# EAGLE schematic VCF-LM324-Stereo-LFO (EAGLE 7.6.0)
Voltage-Controlled Low-Pass Filter with LFO using LM324 Quad-Opamp (Stereo) http://electro-music.com/forum/topic-45231-0.html&postdays=0&postorder=asc&highlight=
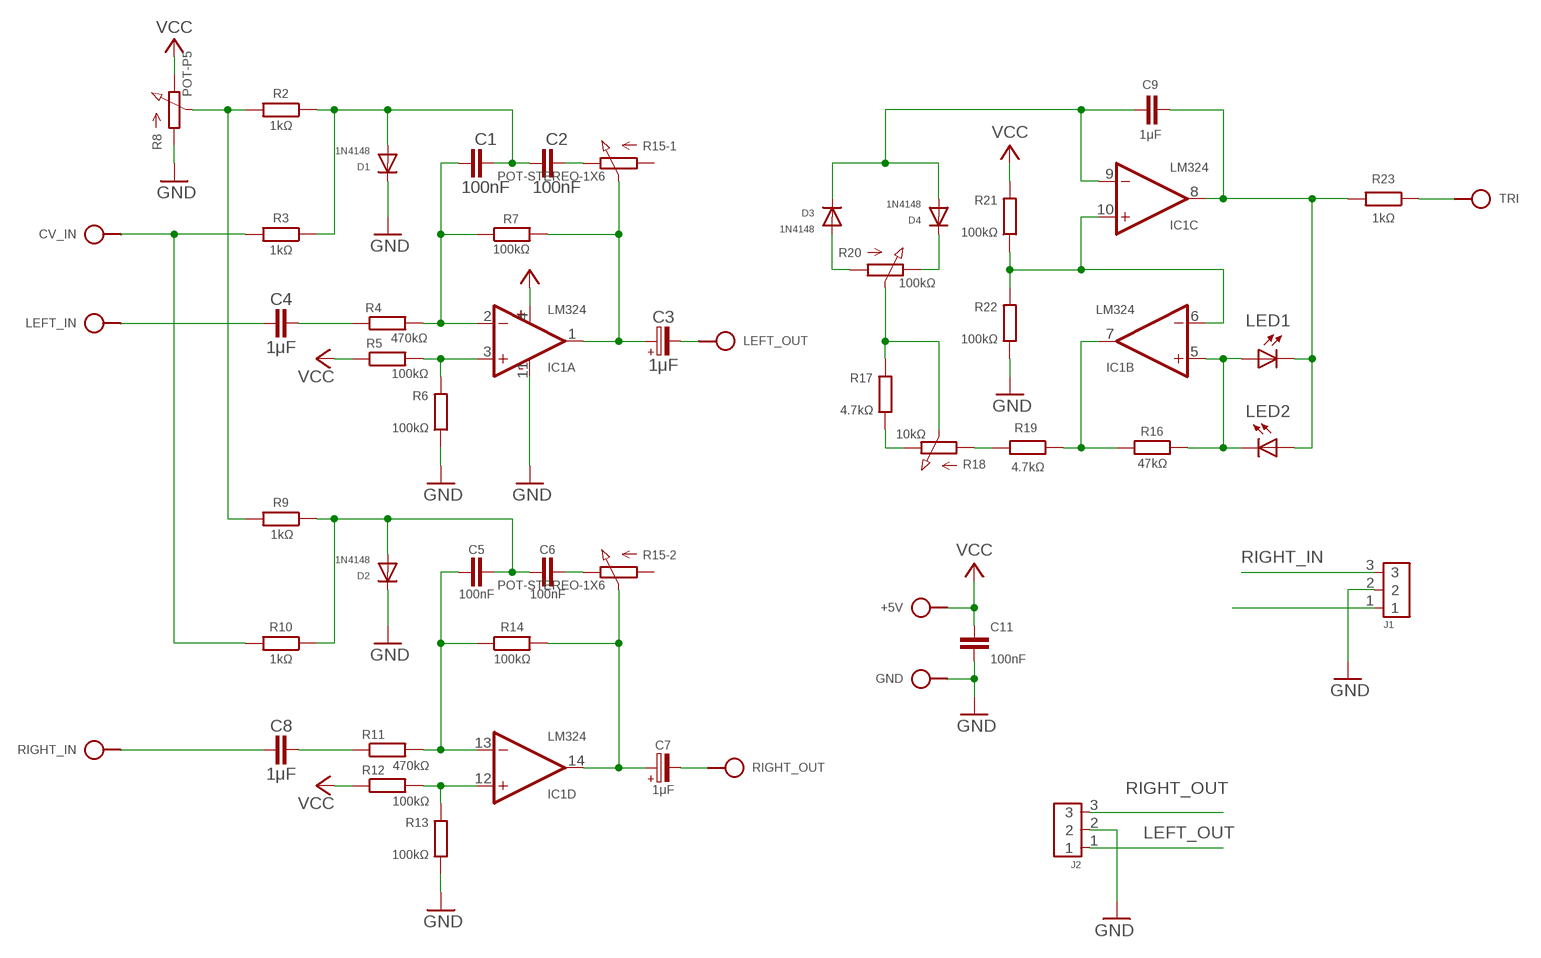
[diagram p0: schematic, sheet 1]

## Parts
+5V  VCC  SPAD  [SPAD]
C1  100nF  C050-024X044  [C050-024X044]
C2  100nF  C050-024X044  [C050-024X044]
C3  1μF  CPOLE2,5-3  [E2,5-3]
C4  1μF  C050-020X044  [C050-020X044]
C5  100nF  C050-024X044  [C050-024X044]
C6  100nF  C050-024X044  [C050-024X044]
C7  1μF  CPOLE2,5-3  [E2,5-3]
C8  1μF  C050-020X044  [C050-020X044]
C9  1μF  C050-024X044/V  [C050-024X044/V]
C11  100nF  C050-020X036  [C050-020X036]
CV_IN  CV_IN  SPAD  [SPAD]
D1  1N4148  1N414834-5  [DO34-5]
D2  1N4148  1N414834-7V  [DO34-7V]
D3  1N4148  1N414834-7V  [DO34-7V]
D4  1N4148  1N414834-7V  [DO34-7V]
GND  GND  SPAD  [SPAD]
IC1  LM324  LM324N  [DIL14]
J1  CONN-3P-3P  [CONN-3P]
J2  CONN-3P-3P  [CONN-3P]
LED1  LED3MM  [LED3MM]
LED2  LED3MM  [LED3MM]
LEFT_IN  AUDIO_IN  SPAD  [SPAD]
LEFT_OUT  AUDIO_OUT  SPAD  [SPAD]
R2  1kΩ  R0204/10-V  [0204/10-V]
R3  1kΩ  R0204/7-V  [0204/7-V]
R4  470kΩ  R0204/10-V  [0204/10-V]
R5  100kΩ  R0204V  [0204V]
R6  100kΩ  R0204/10  [0204/10]
R7  100kΩ  R0204/7-V  [0204/7-V]
R8  POT-P5  [POT-P5]
R9  1kΩ  R0204/7-V  [0204/7-V]
R10  1kΩ  R0202/7-V  [0202/7-V]
R11  470kΩ  R0204/10  [0204/10]
R12  100kΩ  R0204/7-V  [0204/7-V]
R13  100kΩ  R0204V  [0204V]
R14  100kΩ  R0204V  [0204V]
R15  POT-STEREO-1X6  [POT-STEREO-1X6]
R16  47kΩ  R0204/7  [0204/7]
R17  4.7kΩ  R0204/7  [0204/7]
R18  10kΩ  POT  [POT]
R19  4.7kΩ  R0204/7-V  [0204/7-V]
R20  100kΩ  POT  [POT]
R21  100kΩ  R0204/10  [0204/10]
R22  100kΩ  R0202V  [0202V]
R23  1kΩ  R0204/10  [0204/10]
RIGHT_IN  AUDIO_IN  SPAD  [SPAD]
RIGHT_OUT  AUDIO_OUT  SPAD  [SPAD]
TRI  TRIANGLE  SPAD  [SPAD]

## Nets
GND: C11.2 D1.C D2.C GND.1 IC1.11(P:V-) J1.2 J2.2 R6.1 R8.A R13.1 R22.1
LEFT_IN: C4.1 J1.1 LEFT_IN.1
LEFT_OUT: C3.- J2.1 LEFT_OUT.1
N$2: C1.1 IC1.2(A:-IN) R4.2 R7.1
N$3: C2.2 R15.1E(-1:E)
N$4: C3.+ IC1.1(A:OUT) R7.2 R15.1S(-1:S)
N$5: R2.2 R8.S R9.2
N$7: IC1.3(A:+IN) R5.2 R6.2
N$8: CV_IN.1 R3.2 R10.2
N$9: C1.2 C2.1 D1.A R2.1 R3.1
N$10: C4.2 R4.1
N$11: C6.2 R15.2E(-2:E)
N$12: C7.+ IC1.14(D:OUT) R14.2 R15.2S(-2:S)
N$13: IC1.12(D:+IN) R12.2 R13.2
N$14: IC1.7(B:OUT) R16.2 R19.1
N$15: IC1.5(B:+IN) LED1.A LED2.K(C) R16.1
N$16: C5.2 C6.1 D2.A R9.1 R10.1
N$17: C5.1 IC1.13(D:-IN) R11.2 R14.1
N$20: C8.2 R11.1
N$26: C9.1 D3.C D4.A IC1.9(C:-IN)
N$28: C9.2 IC1.8(C:OUT) LED1.K(C) LED2.A R23.2
OA_C_IN+: IC1.6(B:-IN) IC1.10(C:+IN) R21.1 R22.2
RIGHT_IN: C8.1 J1.3 RIGHT_IN.1
RIGHT_OUT: C7.- J2.3 RIGHT_OUT.1
TRI_OUT: R23.1 TRI.1
TRIM_1_A: D3.A R20.1(A)
TRIM_1_B: D4.C R20.3(E)
TRIM_2_A: R17.1 R18.3(E)
TRIM_2_B: R18.1(A) R19.2
TRIM_P: R17.2 R18.2(S) R20.2(S)
VCC: +5V.1 C11.1 IC1.4(P:V+) R5.1 R8.E R12.1 R21.2
Unconnected: R15.1A(-1:A) R15.2A(-2:A)

## Library data of the parts
+5V CV_IN GND LEFT_IN LEFT_OUT RIGHT_IN RIGHT_OUT TRI = pad:SPAD
C1 C2 C4-C6 C8 C9 C11 = c:C: CAPACITOR, European symbol
C3 C7 = c:CPOL: POLARIZED CAPACITOR, European symbol
D1-D4 = d:1N4148
IC1 = ic:LM324: OP AMP
J1 J2 = pinconn:CONN-3P
LED1 LED2 = led:LED: LED OSRAM: - CHIPLED LG R971, LG N971, LY N971, LG Q971, LY Q971, LO R971, LY R971 LH N974, LH R974 LS Q976, LO Q976, LY Q976 LO Q996 - Hyper CHIPLED LW Q18S LB Q993, LB Q99A, LB R99A - SideLED LS A670, LO A670, LY A670, LG A670, LP A670 LB A673, LV A673, LT A673, LW A673 LH A674 LY A675 LS A676, LA A676, LO A676, LY A676, LW A676 LS A679, LY A679, LG A679 - Hyper Micro SIDELED@@ LS Y876, LA Y876, LO Y876, LY Y876 LT Y87S - SmartLED LW L88C, LW L88S LB L89C, LB L89S, LG L890 LS L89K, LO L89K, LY L89K LS L896, LA L896, LO L896, LY L896 - TOPLED LS T670, LO T670, LY T670, LG T670, LP T670 LSG T670, LSP T670, LSY T670, LOP T670, LYG T670 LG T671, LOG T671, LSG T671 LB T673, LV T673, LT T673, LW T673 LH T674 LS T676, LA T676, LO T676, LY T676, LB T676, LH T676, LSB T676, LW T676 LB T67C, LV T67C, LT T67C, LS T67K, LO T67K, LY T67K, LW E67C LS E67B, LA E67B, LO E67B, LY E67B, LB E67C, LV E67C, LT E67C LW T67C LS T679, LY T679, LG T679 LS T770, LO T770, LY T770, LG T770, LP T770 LB T773, LV T773, LT T773, LW T773 LH T774 LS E675, LA E675, LY E675, LS T675 LS T776, LA T776, LO T776, LY T776, LB T776 LHGB T686 LT T68C, LB T68C - Hyper Mini TOPLED@@ LB M676 - Mini TOPLED Santana@@ LG M470 LS M47K, LO M47K, LY M47K Source: http://www.osram.convergy.de LUXEON: - LUMILED@@ LXK2-PW12-R00, LXK2-PW12-S00, LXK2-PW14-U00, LXK2-PW14-V00 LXK2-PM12-R00, LXK2-PM12-S00, LXK2-PM14-U00 LXK2-PE12-Q00, LXK2-PE12-R00, LXK2-PE12-S00, LXK2-PE14-T00, LXK2-PE14-U00 LXK2-PB12-K00, LXK2-PB12-L00, LXK2-PB12-M00, LXK2-PB14-N00, LXK2-PB14-P00, LXK2-PB14-Q00 LXK2-PR12-L00, LXK2-PR12-M00, LXK2-PR14-Q00, LXK2-PR14-R00 LXK2-PD12-Q00, LXK2-PD12-R00, LXK2-PD12-S00 LXK2-PH12-R00, LXK2-PH12-S00 LXK2-PL12-P00, LXK2-PL12-Q00, LXK2-PL12-R00 Source: www.luxeon.com KINGBRIGHT: KA-3528ASYC Source: www.kingbright.com
R2-R7 R9-R14 R16 R17 R19 R21-R23 = r:R: RESISTOR, European symbol
R8 R18 R20 = r:POT
R15 = r:POT-STEREO

## Module LFO
Ports: TRI_OUT(io) GND(io) VCC(io)
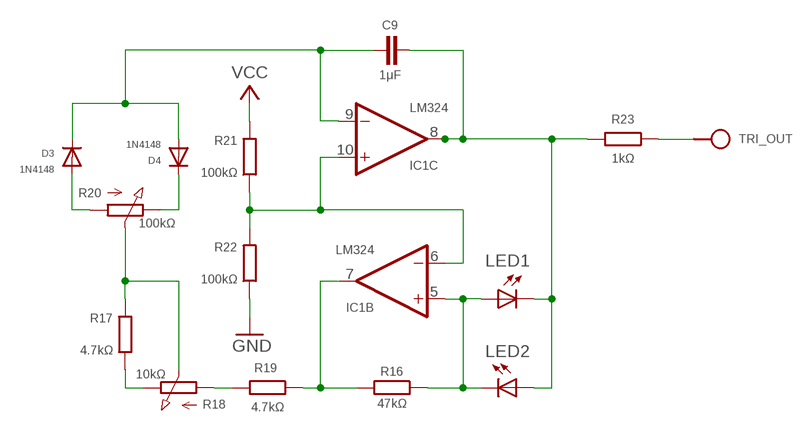
[diagram p1: schematic, module LFO, sheet 1]

### Parts
C9  1μF  C050-024X044/V  [C050-024X044/V]
D3  1N4148  1N414834-7V  [DO34-7V]
D4  1N4148  1N414834-7V  [DO34-7V]
IC1  LM324  LM324N  [DIL14]
LED1  LED3MM  [LED3MM]
LED2  LED3MM  [LED3MM]
R16  47kΩ  R0202/7-V  [0202/7-V]
R17  4.7kΩ  R0202/7  [0202/7]
R18  10kΩ  POT  [POT]
R19  4.7kΩ  R0202/7-V  [0202/7-V]
R20  100kΩ  POT  [POT]
R21  100kΩ  R0202/7-V  [0202/7-V]
R22  100kΩ  R0202/7-V  [0202/7-V]
R23  1kΩ  R0202/7-V  [0202/7-V]
TRI_OUT  TRIANGLE  SPAD  [SPAD]

### Nets
GND: R22.1
N$14: IC1.7(B:OUT) R16.2 R19.1
N$15: IC1.5(B:+IN) LED1.A LED2.K(C) R16.1
N$26: C9.1 D3.C D4.A IC1.9(C:-IN)
N$28: C9.2 IC1.8(C:OUT) LED1.K(C) LED2.A R23.2
OA_C_IN+: IC1.6(B:-IN) IC1.10(C:+IN) R21.1 R22.2
TRI_OUT: R23.1 TRI_OUT.1
TRIM_1_A: D3.A R20.1(A)
TRIM_1_B: D4.C R20.3(E)
TRIM_2_A: R17.1 R18.3(E)
TRIM_2_B: R18.1(A) R19.2
TRIM_P: R17.2 R18.2(S) R20.2(S)
VCC: R21.2
Unconnected: IC1.1(A:OUT) IC1.2(A:-IN) IC1.3(A:+IN) IC1.12(D:+IN) IC1.13(D:-IN) IC1.14(D:OUT)

### Power pins joined to a net without a drawn wire
V+: IC1.4(P:V+)
V-: IC1.11(P:V-)

### Library data of the parts
C9 = c:C: CAPACITOR, European symbol
D3 D4 = d:1N4148
IC1 = ic:LM324: OP AMP
LED1 LED2 = led:LED: LED OSRAM: - CHIPLED LG R971, LG N971, LY N971, LG Q971, LY Q971, LO R971, LY R971 LH N974, LH R974 LS Q976, LO Q976, LY Q976 LO Q996 - Hyper CHIPLED LW Q18S LB Q993, LB Q99A, LB R99A - SideLED LS A670, LO A670, LY A670, LG A670, LP A670 LB A673, LV A673, LT A673, LW A673 LH A674 LY A675 LS A676, LA A676, LO A676, LY A676, LW A676 LS A679, LY A679, LG A679 - Hyper Micro SIDELED@@ LS Y876, LA Y876, LO Y876, LY Y876 LT Y87S - SmartLED LW L88C, LW L88S LB L89C, LB L89S, LG L890 LS L89K, LO L89K, LY L89K LS L896, LA L896, LO L896, LY L896 - TOPLED LS T670, LO T670, LY T670, LG T670, LP T670 LSG T670, LSP T670, LSY T670, LOP T670, LYG T670 LG T671, LOG T671, LSG T671 LB T673, LV T673, LT T673, LW T673 LH T674 LS T676, LA T676, LO T676, LY T676, LB T676, LH T676, LSB T676, LW T676 LB T67C, LV T67C, LT T67C, LS T67K, LO T67K, LY T67K, LW E67C LS E67B, LA E67B, LO E67B, LY E67B, LB E67C, LV E67C, LT E67C LW T67C LS T679, LY T679, LG T679 LS T770, LO T770, LY T770, LG T770, LP T770 LB T773, LV T773, LT T773, LW T773 LH T774 LS E675, LA E675, LY E675, LS T675 LS T776, LA T776, LO T776, LY T776, LB T776 LHGB T686 LT T68C, LB T68C - Hyper Mini TOPLED@@ LB M676 - Mini TOPLED Santana@@ LG M470 LS M47K, LO M47K, LY M47K Source: http://www.osram.convergy.de LUXEON: - LUMILED@@ LXK2-PW12-R00, LXK2-PW12-S00, LXK2-PW14-U00, LXK2-PW14-V00 LXK2-PM12-R00, LXK2-PM12-S00, LXK2-PM14-U00 LXK2-PE12-Q00, LXK2-PE12-R00, LXK2-PE12-S00, LXK2-PE14-T00, LXK2-PE14-U00 LXK2-PB12-K00, LXK2-PB12-L00, LXK2-PB12-M00, LXK2-PB14-N00, LXK2-PB14-P00, LXK2-PB14-Q00 LXK2-PR12-L00, LXK2-PR12-M00, LXK2-PR14-Q00, LXK2-PR14-R00 LXK2-PD12-Q00, LXK2-PD12-R00, LXK2-PD12-S00 LXK2-PH12-R00, LXK2-PH12-S00 LXK2-PL12-P00, LXK2-PL12-Q00, LXK2-PL12-R00 Source: www.luxeon.com KINGBRIGHT: KA-3528ASYC Source: www.kingbright.com
R16 R17 R19 R21-R23 = r:R: RESISTOR, European symbol
R18 R20 = r:POT
TRI_OUT = pad:SPAD

## Module VCF-L
Ports: 

### Library data of the parts